# EAGLE design adapter_r5 (EAGLE 7.2.0)
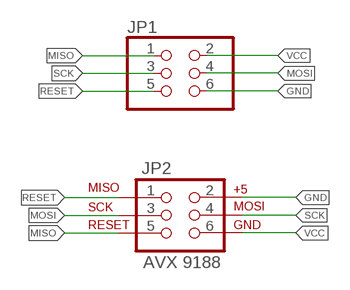
[diagram p0: schematic, sheet 1]

## Parts
JP1  PINHD-2X03_2.54-SMD  [2X03SMD]
JP2  AVX 9188  ISPTOUCH_ADAPTER  [AVX_9188_6-WAY_SMT]

## Nets
GND: JP1.6 JP2.2
MISO: JP1.1 JP2.5
MOSI: JP1.4 JP2.3
RESET: JP1.5 JP2.1
SCK: JP1.3 JP2.4
VCC: JP1.2 JP2.6

## Library data of the parts
JP1 = pinhead-2:PINHD-2X03: PIN HEADER
JP2 = prg_header:ISPTOUCH: ISPtouch for AVR Microcontrollers This 6-pin ISP connector for AVR programming does not require any part on the PCB, but an adapter for a common 6-pin programmer.

## Board
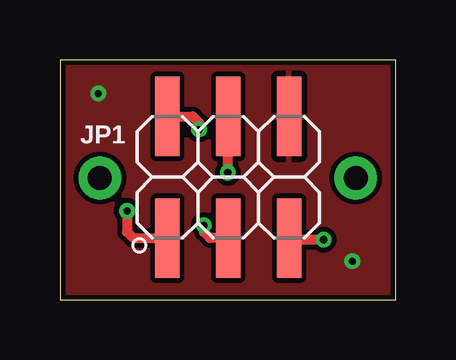
[diagram p1: board, top side]
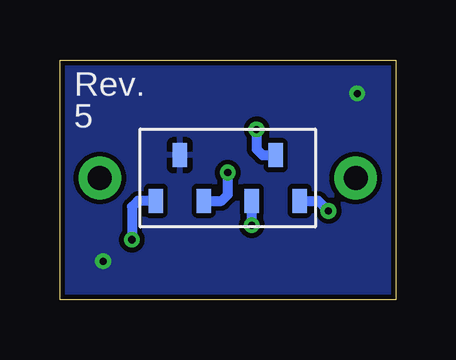
[diagram p2: board, bottom side, seen from below]

Size 14 x 10 mm. Coordinates in mm from the lower left corner, seen from the top.
Outline: 0,10 0,0 14,0 14,10 0,10
Copper layers (1*16): Top 0.0356mm / dielectric 1.5011mm / Bottom 0.0356mm
Design rules "default *": minimum track width 8mil, minimum drill 0.3mm, track to track 8mil, track to pad 8mil, pad to pad 6mil, via to via 6mil, smd to smd 6mil, copper to edge 8mil, drill to drill 6mil, minimum pad ring 7mil, minimum via ring 7mil, stop-mask expansion 0mil, vias tented up to drill 0mil, thermal gap 10mil

### Footprints (pad centres in the part's own frame; a part is rotated, then mirrored left to right if it is on the bottom)
2X03SMD = smd 1.016 x 3.302: 1 -1.27,-3.81; 2 -1.27,1.27; 3 1.27,-3.81; 4 1.27,1.27; 5 3.81,-3.81; 6 3.81,1.27
AVX_9188_6-WAY_SMT = smd 0.6 x 1: 1 -3,-0.95; 2 -2,0.95; 3 -1,-0.95; 4 1,-0.95; 5 3,-0.95; 6 2,0.95

### Placement (x,y rotation side)
JP1  5.75,6.37 0 top
JP2  7,5.07 0 bottom

### Tracks (layer width: path | path; a pad name or v marks a point on that pad's centre or on a via)
GND  (via drill 0.3)
  other vias: 1.6,8.6 12.2,1.6
  pour Top: 0.1,0 0.1,10 14,10 14,0
  pour Bottom: 14,0 0,0 0,9.75 0.25,10 14,10
MISO  (via drill 0.3)
  Top 0.406: v2.8,3.7 2.8,2.82 3.05,2.56 JP1.1
  Bottom 0.406: JP2.5 3.22,4.12 v2.8,3.7
MOSI  (via drill 0.3)
  Top 0.406: v7,5.3 7.02,5.32 JP1.4
  Bottom 0.406: JP2.3 7.25,4.12 7,4.38 v7,5.3
N$7  (via drill 1 pad 1.78)
  other vias: 1.67,5.07
N$8  (via drill 1 pad 1.78)
  other vias: 12.33,5.07
RESET  (via drill 0.3)
  Top 0.406: v11,2.5 9.62,2.5 JP1.5
  Bottom 0.406: JP2.1 10.75,4.12 11,3.87 v11,2.5
SCK  (via drill 0.3)
  Top 0.406: JP1.3 6.25,2.56 6,2.82 v6,3.1
  Bottom 0.406: v6,3.1 JP2.4
VCC  (via drill 0.3)
  Top 0.406: JP1.2 5.55,7.64 5.8,7.39 v5.8,7.1
  Bottom 0.406: v5.8,7.1 5.8,6.28 5.55,6.02 JP2.6

### Text on the board
bPlace: Rev. | 5